# EAGLE design pre4 (EAGLE 5.10)
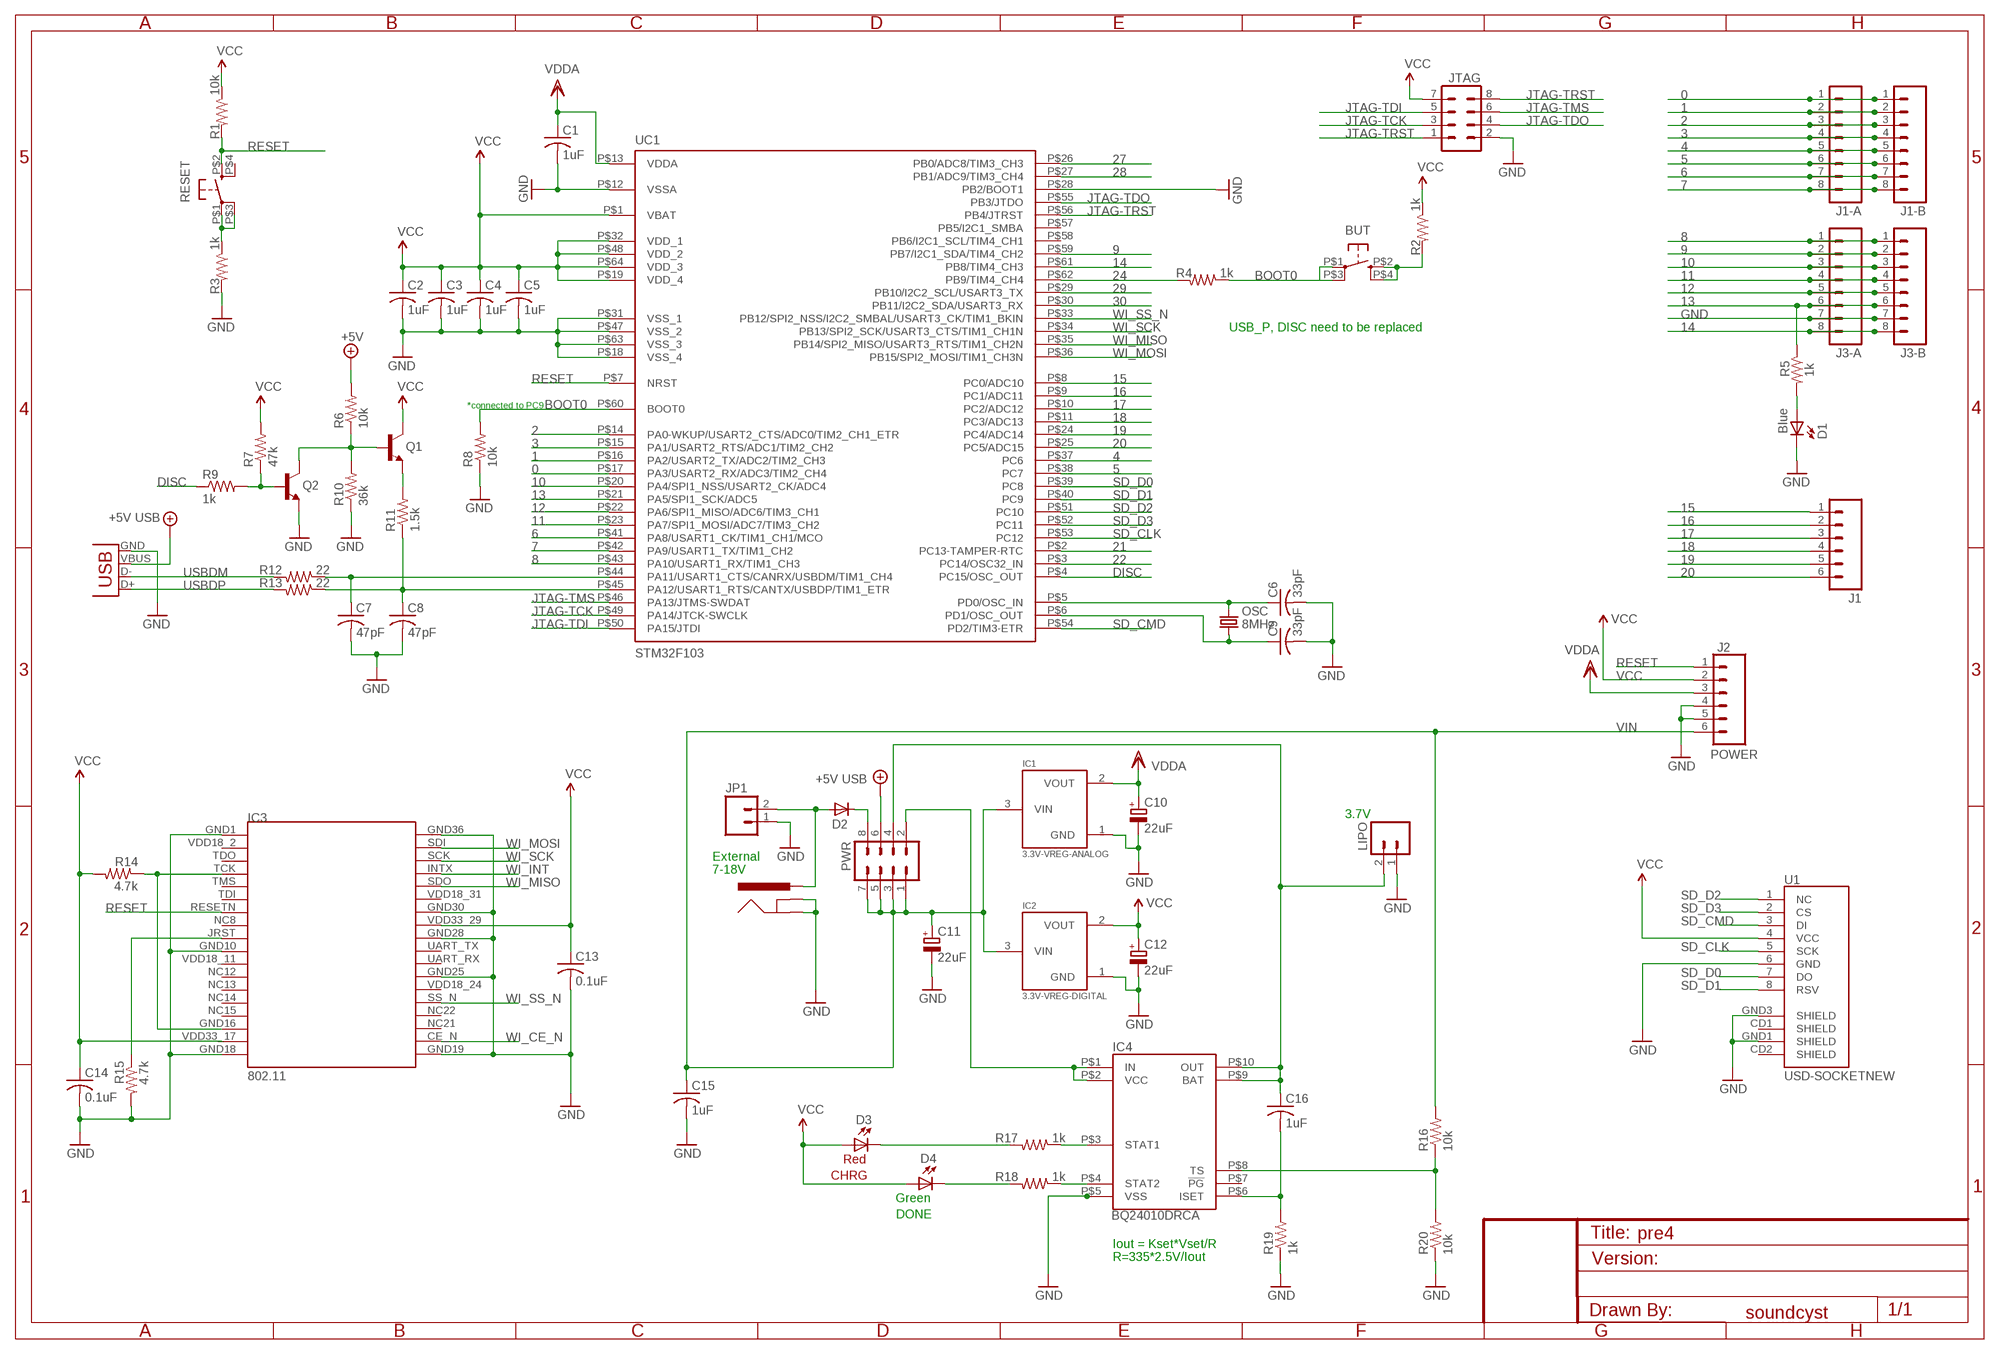
[diagram p0: schematic, sheet 1]

## Parts
BAR  POWER_JACKPTH  [POWER_JACK_PTH]
BUT  BUTTON-KMR241GLFS  [PUSHBUTTON-KMR241GLFS]
C1  1uF  C  [C0603]
C2  1uF  C  [C0603]
C3  1uF  C  [C0603]
C4  1uF  C  [C0603]
C5  1uF  C  [C0603]
C6  33pF  C  [C0603]
C7  47pF  C  [C0603]
C8  47pF  C  [C0603]
C9  33pF  C  [C0603]
C10  22uF  CPOL-EUUD-4X5,8  [UD-4X5,8_NICHICON]
C11  22uF  CPOL-EUUD-4X5,8  [UD-4X5,8_NICHICON]
C12  22uF  CPOL-EUUD-4X5,8  [UD-4X5,8_NICHICON]
C13  0.1uF  C  [C0603]
C14  0.1uF  C  [C0603]
C15  1uF  C  [C0603]
C16  1uF  C  [C0603]
D1  Blue  LED0603  [LED-0603]
D2  DIODE-SOD323-W  [SOD323-W]
D3  Red  LED0603  [LED-0603]
D4  Green  LED0603  [LED-0603]
IC1  3.3V-VREG-ANALOG  MCP1700T  [SOT23]
IC2  3.3V-VREG-DIGITAL  MCP1700T  [SOT23]
IC3  802.11  ZG2100MOD  [ZG2100MOD]
IC4  BQ24010DRCA  [PSON10-V2]
J1  M06SIP  [1X06]
J1-A  M08  [1X08]
J1-B  MA08-SQUARE  [1X08-SQUARE]
J2  POWER  M06SIP  [1X06]
J3-A  M08  [1X08]
J3-B  MA08-SQUARE  [1X08-SQUARE]
JP1  M02PTH  [1X02]
JTAG  MA04-2  [MA04-2]
LIPO  LiPo  M02-JST-2MM-SMT  [S2B-PH]
OSC  8MHz  CRYSTAL5X3  [CRYSTAL-SMD-5X3]
PWR  MA04-2  [MA04-2]
Q1  TRANSISTOR_NPNSOT23  [SOT23]
Q2  TRANSISTOR_NPNSOT23  [SOT23]
R1  10k  R  [R0603]
R2  1k  R  [R0603]
R3  1k  R  [R0603]
R4  1k  R  [R0603]
R5  1k  R  [R0603]
R6  10k  R  [R0603]
R7  47k  R  [R0603]
R8  10k  R  [R0603]
R9  1k  R  [R0603]
R10  36k  R  [R0603]
R11  1.5k  R  [R0603]
R12  22  R  [R0603]
R13  22  R  [R0603]
R14  4.7k  R  [R0603]
R15  4.7k  R  [R0603]
R16  10k  R  [R0603]
R17  1k  R  [R0603]
R18  1k  R  [R0603]
R19  1k  R  [R0603]
R20  10k  R  [R0603]
RESET  BUTTON-KMR241GLFS  [PUSHBUTTON-KMR241GLFS]
U1  USD-SOCKETNEW  [MICRO-SD-SOCKET-PP]
UC1  STM32F103  [TQFP-10X10-64]
X1  USBSMD  [USB-MINIB]

## Nets
0: J1-A.1 J1-B.1 UC1.P$17(PA3/USART2_RX/ADC3/TIM2_CH4)
1: J1-A.2 J1-B.2 UC1.P$16(PA2/USART2_TX/ADC2/TIM2_CH3)
2: J1-A.3 J1-B.3 UC1.P$14(PA0-WKUP/USART2_CTS/ADC0/TIM2_CH1_ETR)
3: J1-A.4 J1-B.4 UC1.P$15(PA1/USART2_RTS/ADC1/TIM2_CH2)
4: J1-A.5 J1-B.5 UC1.P$37(PC6)
5: J1-A.6 J1-B.6 UC1.P$38(PC7)
6: J1-A.7 J1-B.7 UC1.P$41(PA8/USART1_CK/TIM1_CH1/MCO)
7: J1-A.8 J1-B.8 UC1.P$42(PA9/USART1_TX/TIM1_CH2)
8: J3-A.1 J3-B.1 UC1.P$43(PA10/USART1_RX/TIM1_CH3)
9: J3-A.2 J3-B.2 UC1.P$59(PB7/I2C1_SDA/TIM4_CH2)
10: J3-A.3 J3-B.3 UC1.P$20(PA4/SPI1_NSS/USART2_CK/ADC4)
11: J3-A.4 J3-B.4 UC1.P$23(PA7/SPI1_MOSI/ADC7/TIM3_CH2)
12: J3-A.5 J3-B.5 UC1.P$22(PA6/SPI1_MISO/ADC6/TIM3_CH1)
13: J3-A.6 J3-B.6 R5.1 UC1.P$21(PA5/SPI1_SCK/ADC5)
14: J3-A.8 J3-B.8 UC1.P$61(PB8/TIM4_CH3)
15: J1.1 UC1.P$8(PC0/ADC10)
16: J1.2 UC1.P$9(PC1/ADC11)
17: J1.3 UC1.P$10(PC2/ADC12)
18: J1.4 UC1.P$11(PC3/ADC13)
19: J1.5 UC1.P$24(PC4/ADC14)
20: J1.6 UC1.P$25(PC5/ADC15)
21: UC1.P$2(PC13-TAMPER-RTC)
22: UC1.P$3(PC14/OSC32_IN)
24: R4.2 UC1.P$62(PB9/TIM4_CH4)
27: UC1.P$26(PB0/ADC8/TIM3_CH3)
28: UC1.P$27(PB1/ADC9/TIM3_CH4)
29: UC1.P$29(PB10/I2C2_SCL/USART3_TX)
30: UC1.P$30(PB11/I2C2_SDA/USART3_RX)
+5V: PWR.6 R6.2 X1.VBUS ; supply symbol labelled +5V USB
BOOT0: BUT.P$1 BUT.P$3 R4.1 R8.2 UC1.P$60(BOOT0)
DISC: R9.1 UC1.P$4(PC15/OSC_OUT)
GND [vcc]: BAR.GND BAR.GNDBREAK C1.2 C2.2 C3.2 C4.2 C5.2 C6.2 C7.2 C8.2 C9.2 C10.- C11.- C12.- C13.2 C14.2 C15.2 D1.C IC1.1(GND) IC2.1(GND) IC3.GND1 IC3.GND10 IC3.GND18 IC3.GND19 IC3.GND25 IC3.GND28 IC3.GND30 IC3.GND36 IC4.P$5(VSS) J2.4 J2.5 J3-A.7 J3-B.7 JP1.1 JTAG.2 LIPO.1 Q2.2(E) R3.2 R8.1 R10.1 R15.2 R19.1 R20.1 U1.6(GND) U1.GND1(SHIELD) U1.GND3(SHIELD) UC1.P$12(VSSA) UC1.P$18(VSS_4) UC1.P$28(PB2/BOOT1) UC1.P$31(VSS_1) UC1.P$47(VSS_2) UC1.P$63(VSS_3) X1.GND
JTAG-TCK: JTAG.3 UC1.P$49(PA14/JTCK-SWCLK)
JTAG-TDI: JTAG.5 UC1.P$50(PA15/JTDI)
JTAG-TDO: JTAG.4 UC1.P$55(PB3/JTDO)
JTAG-TMS: JTAG.6 UC1.P$46(PA13/JTMS-SWDAT)
JTAG-TRST: JTAG.1 JTAG.8 UC1.P$56(PB4/JTRST)
N$1 [vcc]: BAR.PWR D2.A JP1.2
N$2: C9.1 OSC.1 UC1.P$6(PD1/OSC_OUT)
N$3: IC4.P$8(TS) R16.1 R20.2
N$5: D2.C PWR.8
N$6: C6.1 OSC.3 UC1.P$5(PD0/OSC_IN)
N$7: D1.A R5.2
N$8: Q1.2(E) R11.2
N$9: Q1.1(B) Q2.3(C) R6.1 R10.2
N$10: Q2.1(B) R7.1 R9.2
N$11: C7.1 R12.1 UC1.P$44(PA11/USART1_CTS/CANRX/USBDM/TIM1_CH4)
N$12: C8.1 R11.1 R13.1 UC1.P$45(PA12/USART1_RTS/CANTX/USBDP/TIM1_ETR)
N$13: IC4.P$1(IN) IC4.P$2(VCC) PWR.2
N$16 [vcc]: C16.1 IC4.P$9(BAT) IC4.P$10(OUT) LIPO.2 PWR.4
N$18: IC3.GND16 IC3.TCK R14.1
N$19: C16.2 IC4.P$6(ISET) R19.2
N$20: D4.C R18.2
N$21: D3.C R17.2
N$22: IC4.P$3(STAT1) R17.1
N$23: IC4.P$4(STAT2) R18.1
N$25 [vcc]: R3.1 RESET.P$1 RESET.P$3
N$26: BUT.P$2 BUT.P$4 R2.2
N$27: IC3.JRST R15.1
RESET: IC3.RESETN(RSTN) J2.1 R1.2 RESET.P$2 UC1.P$7(NRST)
SD_CLK: U1.5(SCK) UC1.P$53(PC12)
SD_CMD: U1.3(DI) UC1.P$54(PD2/TIM3-ETR)
SD_D0: U1.7(DO) UC1.P$39(PC8)
SD_D1: U1.8(RSV) UC1.P$40(PC9)
SD_D2: U1.1(NC) UC1.P$51(PC10)
SD_D3: U1.2(CS) UC1.P$52(PC11)
USBDM: R12.2 X1.D-
USBDP: R13.2 X1.D+
VCC: C2.1 C3.1 C4.1 C5.1 C12.+ C13.1 C14.1 D3.A D4.A IC2.2(VOUT) IC3.VDD33_17 IC3.VDD33_29 J2.2 JTAG.7 Q1.3(C) R1.1 R2.1 R7.2 R14.2 U1.4(VCC) UC1.P$1(VBAT) UC1.P$19(VDD_4) UC1.P$32(VDD_1) UC1.P$48(VDD_2) UC1.P$64(VDD_3)
VDD: C1.1 C10.+ IC1.2(VOUT) J2.3 UC1.P$13(VDDA) ; supply symbol labelled VDDA
VIN: C11.+ C15.1 IC1.3(VIN) IC2.3(VIN) J2.6 PWR.1 PWR.3 PWR.5 PWR.7 R16.2
WI_CE_N: IC3.CE_N
WI_INT: IC3.INTX
WI_MISO: IC3.SDO UC1.P$35(PB14/SPI2_MISO/USART3_RTS/TIM1_CH2N)
WI_MOSI: IC3.SDI UC1.P$36(PB15/SPI2_MOSI/TIM1_CH3N)
WI_SCK: IC3.SCK UC1.P$34(PB13/SPI2_SCK/USART3_CTS/TIM1_CH1N)
WI_SS_N: IC3.SS_N UC1.P$33(PB12/SPI2_NSS/I2C2_SMBAL/USART3_CK/TIM1_BKIN)
Unconnected: IC3.NC8 IC3.NC12 IC3.NC13 IC3.NC14 IC3.NC15 IC3.NC21 IC3.NC22 IC3.TDI IC3.TDO IC3.TMS IC3.UART_RX IC3.UART_TX IC3.VDD18_2 IC3.VDD18_11 IC3.VDD18_24 IC3.VDD18_31 IC4.P$7(!PG) RESET.P$4 U1.CD1(SHIELD) U1.CD2(SHIELD) UC1.P$57(PB5/I2C1_SMBA) UC1.P$58(PB6/I2C1_SCL/TIM4_CH1)

## Notes on the sheet
- USB_P, DISC need to be replaced
- *connected to PC9
- 3.7V
- External
- 7-18V
- CHRG
- DONE
- Iout = Kset*Vset/R
- R=335*2.5V/Iout
- soundcyst

## Library data of the parts
BAR = SparkFun2:POWER_JACK: Power Jack This is the standard 5.5mm barrel jack for power. The PTH is the most common, proven, reliable, footprint. All others are experimental. The Slot footprint only works if the mill layer is transmitted to the PCB fab house so be warned. Spark Fun Electronics SKU : PRT-00119. Mating wall wart : TOL-00298 (and others)
BUT RESET = okie:BUTTON-KMR241GLFS
C1-C9 C13-C16 = ReplenishComponentLib:C
C10-C12 = rcl:CPOL-EU: POLARIZED CAPACITOR, European symbol
D1 D3 D4 = SparkFun:LED: LEDs Standard schematic elements and footprints for 5mm, 3mm, 1206, and 0603 sized LEDs. 5mm - Spark Fun Electronics SKU : COM-00529 (and others)
D2 = diode:DIODE-: DIODE
IC1 IC2 = okie:MCP1700T
IC3 = ZGLIB:ZG2100MOD: ZG2100 Module
IC4 = xkn_lib:BQ24010DRC
J1 J2 = SparkFun:M06: Header 6 Standard 6-pin 0.1" header. Use with straight break away headers (SKU : PRT-00116), right angle break away headers (PRT-00553), swiss pins (PRT-00743), machine pins (PRT-00117), and female headers (PRT-00115). Molex polarized connector foot print use with SKU : PRT-08094 with associated crimp pins and housings.
J1-A J3-A = SparkFun:M08: Header 8 Standard 8-pin 0.1" header. Use with straight break away headers (SKU : PRT-00116), right angle break away headers (PRT-00553), swiss pins (PRT-00743), machine pins (PRT-00117), and female headers (PRT-00115).
J1-B J3-B = SparkFun2:MA08-SQUARE
JP1 = SparkFun2:M02: Header 2 Standard 2-pin 0.1" header. Use with straight break away headers (SKU : PRT-00116), right angle break away headers (PRT-00553), swiss pins (PRT-00743), machine pins (PRT-00117), and female headers (PRT-00115). Molex polarized connector foot print use with SKU : PRT-08233 with associated crimp pins and housings.
JTAG PWR = con-lstb:MA04-2: PIN HEADER
LIPO = SparkFun:M02: Header 2 Standard 2-pin 0.1" header. Use with straight break away headers (SKU : PRT-00116), right angle break away headers (PRT-00553), swiss pins (PRT-00743), machine pins (PRT-00117), and female headers (PRT-00115). Molex polarized connector foot print use with SKU : PRT-08233 with associated crimp pins and housings.
OSC = SparkFun2:CRYSTAL: Crystals Various standard crystals. Proven footprints. Spark Fun Electronics SKU : COM-00534
Q1 Q2 = SparkFun2:TRANSISTOR_NPN: Transistor NPN BJT configuration in SOT23 package. MMBT2222 is the common NPN we use. Double check BCE configuration again layout.
R1-R20 = ReplenishComponentLib:R
U1 = SparkFun:USD-SOCKET: microSD Socket Push-push type uSD socket. Schematic element and footprint production proven. Spark Fun Electronics SKU : PRT-00127. tDoc lines correctly indicate media card edge positions when inserting (unlocked, locked, depressed).
UC1 = st-microelectronics:STM32F103
X1 = SparkFun2:USB: USB Connectors USB-B-PTH is fully proven SKU : PRT-00139 USB-miniB is fully proven SKU : PRT-00587 USB-A-PCB is untested. USB-A-H is throughly reviewed, but untested. Spark Fun Electronics SKU : PRT-00437 USB-B-SMT is throughly reviewed, but untested. Needs silkscreen touching up. USB-A-S has not been used/tested USB-MB-H has not been used/tested

## Net classes
0 default: width 0.203 mm, clearance 0.152 mm
1 vcc: width 0.254 mm, clearance 0.152 mm
2 gnd: width 0.305 mm, drill 0.508 mm, clearance 0.152 mm
3 usbvcc: width 0.508 mm, drill 0.508 mm, clearance 0.152 mm

## Board
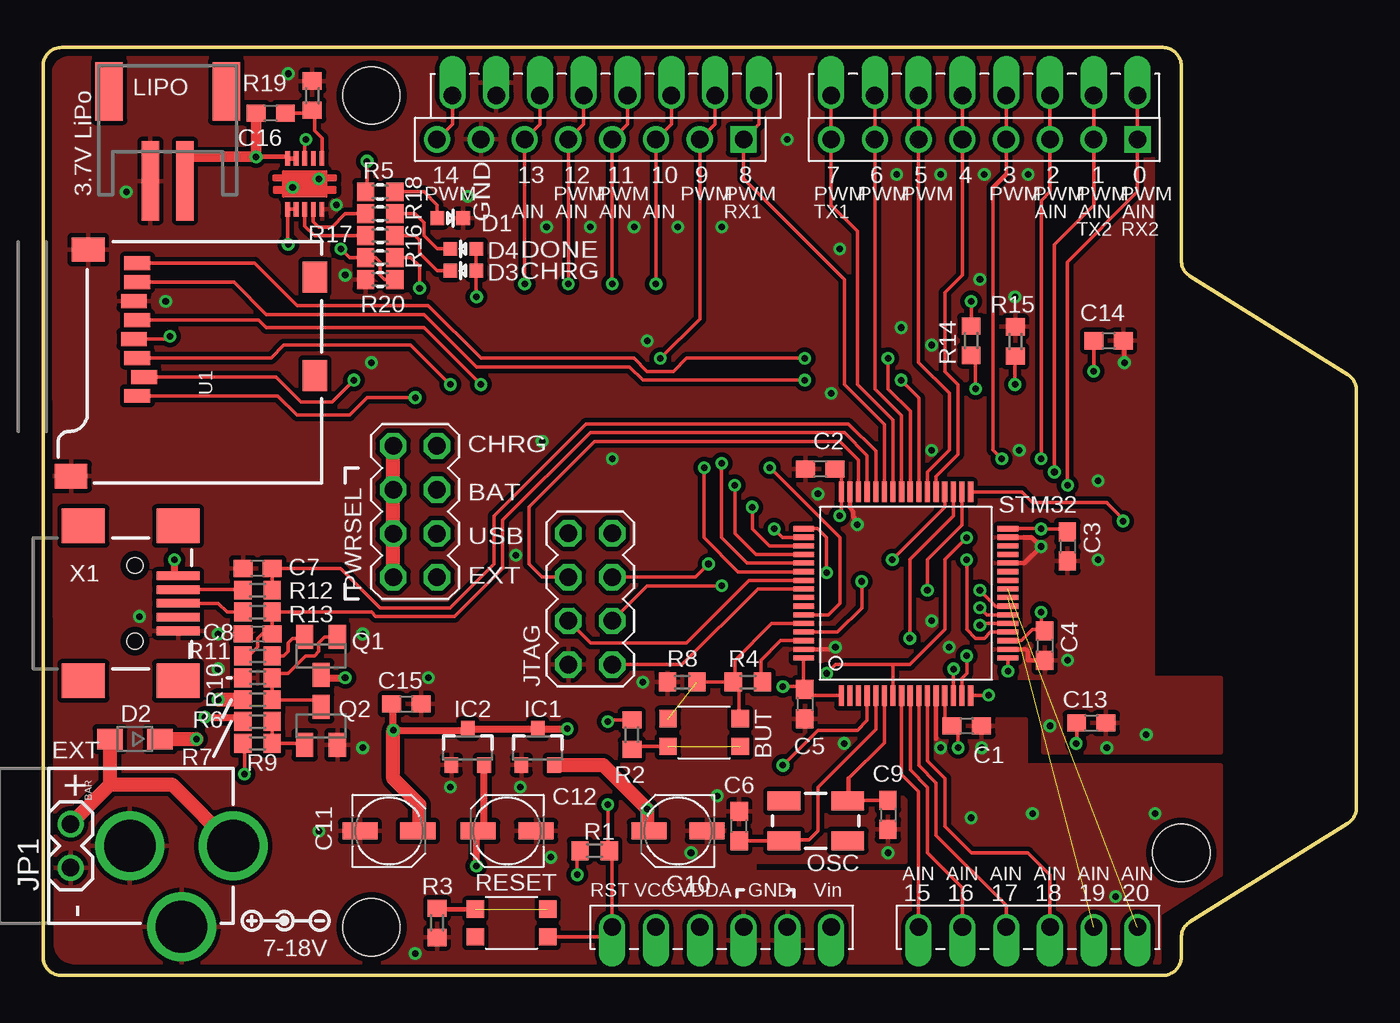
[diagram p1: board, top side]
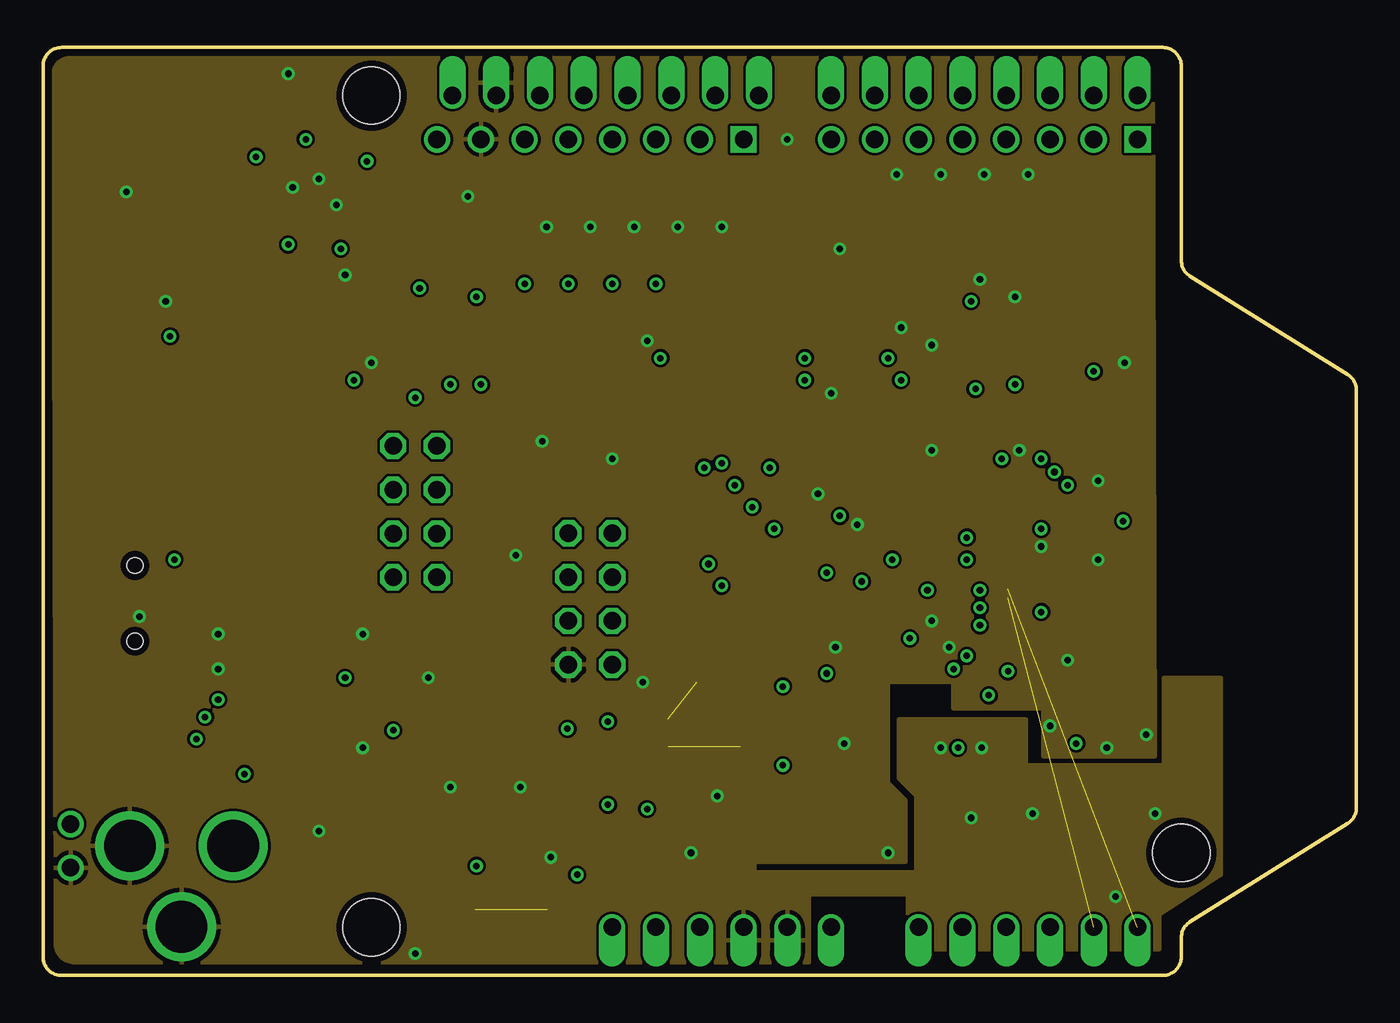
[diagram p2: board, inner layer gndplane]
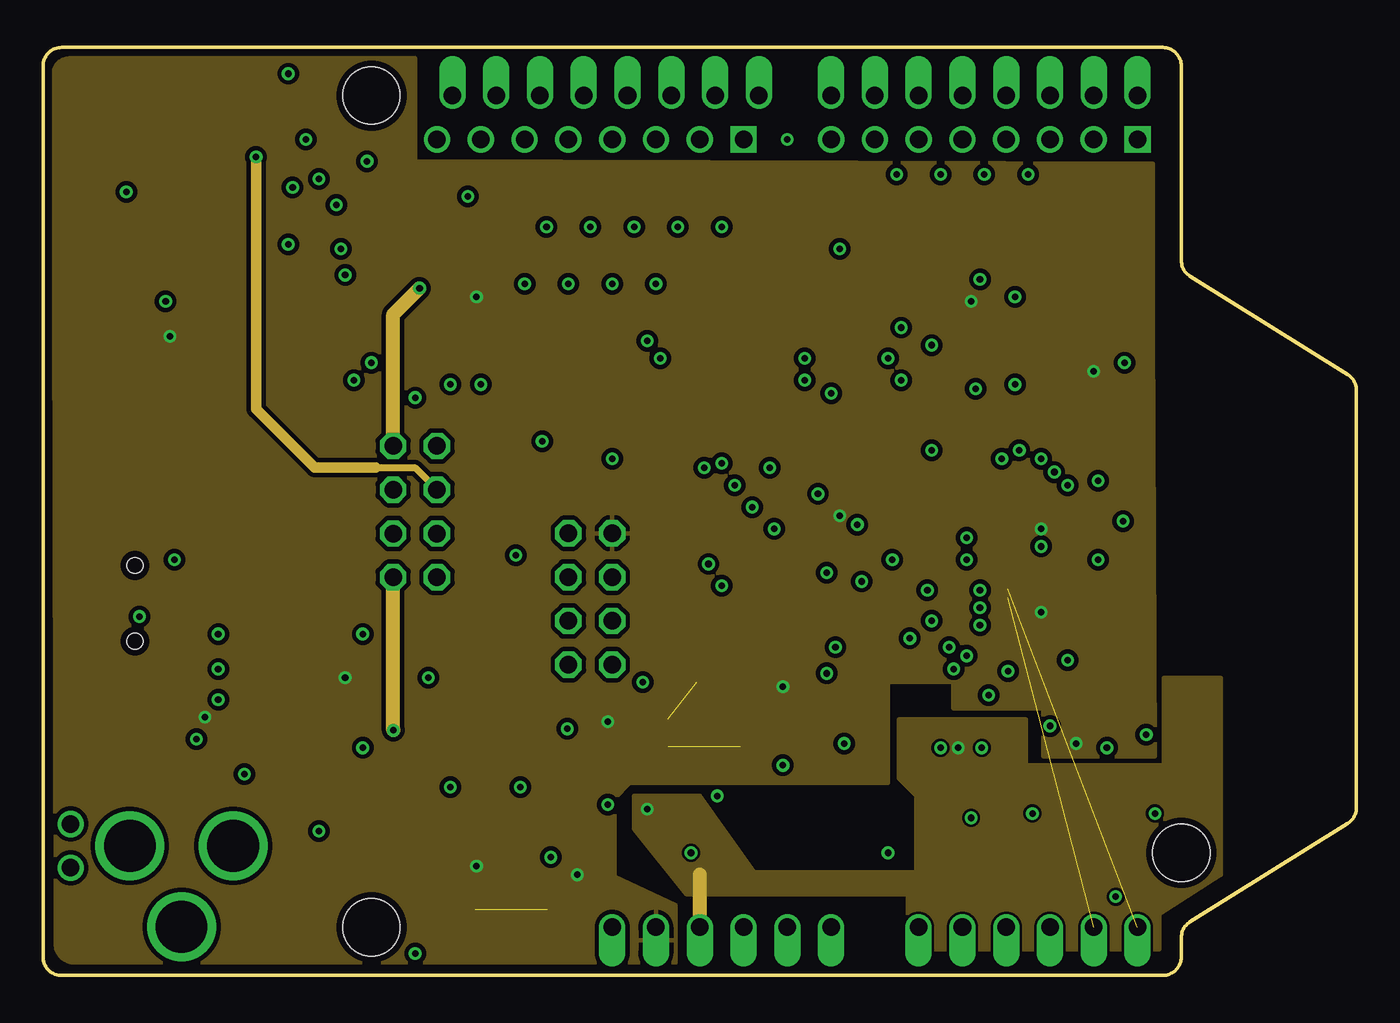
[diagram p3: board, inner layer Route15]
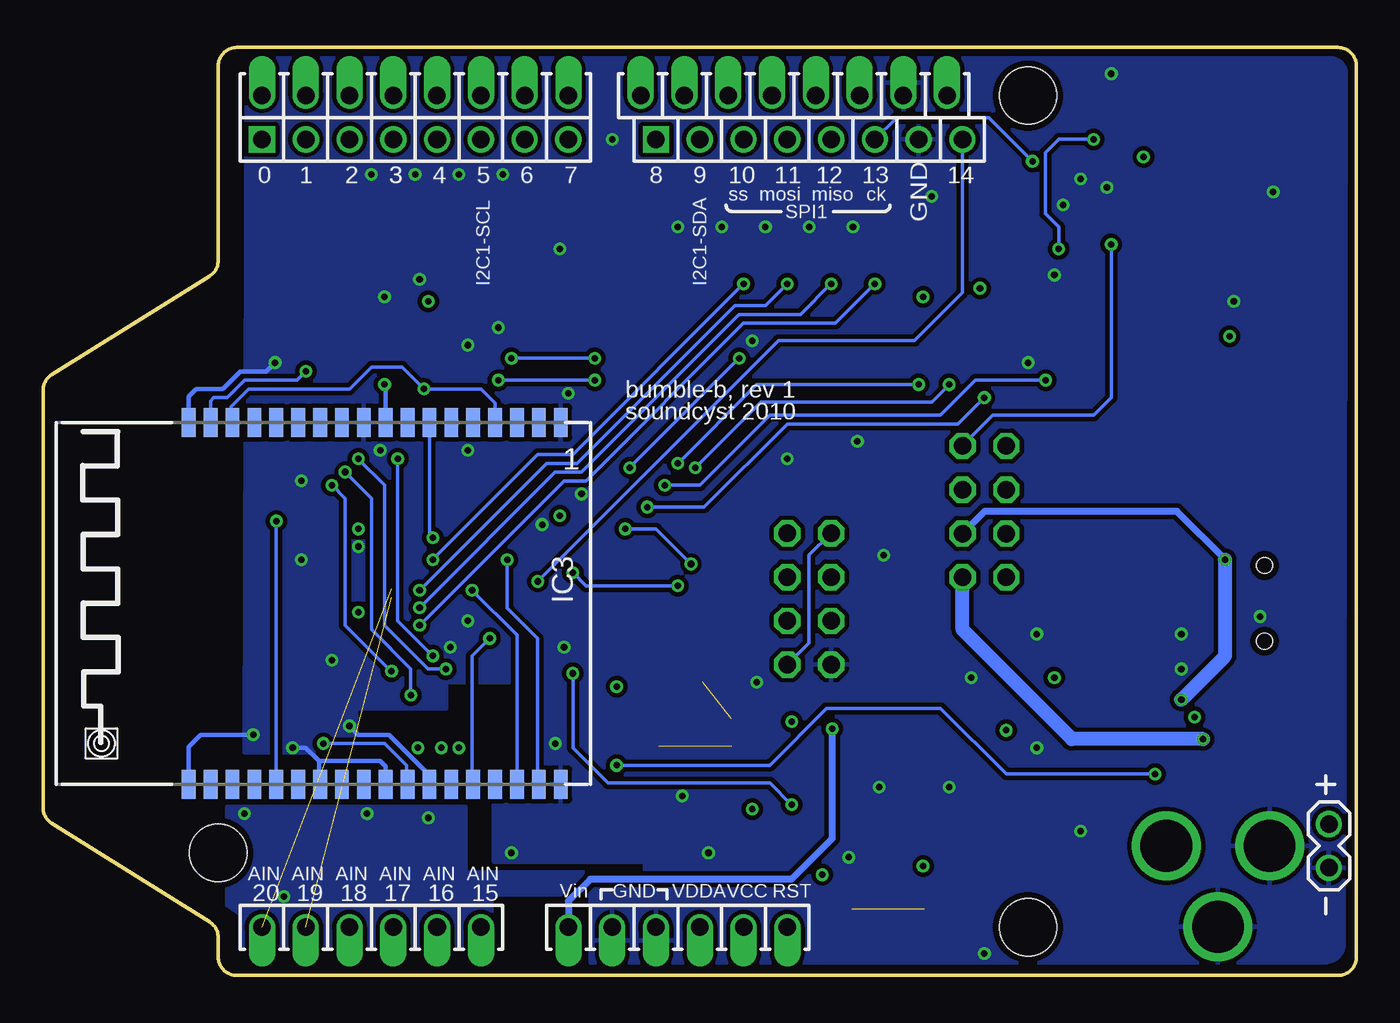
[diagram p4: board, bottom side, seen from below]

Size 76.2 x 53.85 mm. Coordinates in mm from the lower left corner, seen from the top.
Outline: 75.69,8.83 arc58 76.2,9.74 76.2,33.95 arc58 75.69,34.86 66.55,40.58 arc-58 66.04,41.49 66.04,52.77 arc90 64.96,53.85 1.08,53.85 arc90 0,52.77 0,1.08 arc90 1.08,0 64.96,0 arc90 66.04,1.08 66.04,2.2 arc-58 66.55,3.11 75.69,8.83
Copper layers (1*2*15*16): Top 0.0356mm / dielectric 1.5011mm / gndplane 0.0356mm / dielectric 0.1499mm / Route15 0.0356mm / dielectric 0.2007mm / Bottom 0.0356mm
Design rules "LaenPCBOrder *": minimum track width 6mil, minimum drill 13mil, track to track 6mil, track to pad 6mil, pad to pad 6mil, via to via 6mil, smd to smd 6mil, copper to edge 15mil, drill to drill 6mil, minimum pad ring 7mil, minimum via ring 7mil, stop-mask expansion 4mil, vias tented up to drill 0mil, thermal gap 10mil

### Footprints (pad centres in the part's own frame; a part is rotated, then mirrored left to right if it is on the bottom)
POWER_JACK_PTH = drill 2.997 round: GND 0,7.7; GNDBREAK 4.7,10.7; PWR 0,13.7
PUSHBUTTON-KMR241GLFS = smd 1 x 1: P$1 2.1,0.8; P$2 2.1,-0.8; P$3 -2.1,0.8; P$4 -2.1,-0.8
C0603 = smd 1.1 x 1: 1 -0.85,0; 2 0.85,0
UD-4X5,8_NICHICON = smd 2.032 x 1: + 1.679,0; - -1.679,0
LED-0603 = smd 0.8 x 0.8: A 0,-0.75; C 0,0.75
SOD323-W = smd 1.5 x 1.2: A 1.45,0; C -1.45,0
SOT23 = smd 0.8 x 0.9: 1 -0.95,-1; 2 0.95,-1; 3 0,1.1
ZG2100MOD = smd 0.8 x 1.7: CE_N 6.63,10.12; GND1 -13.69,-10.88; GND10 -2.26,-10.88; GND16 5.36,-10.88; GND18 7.9,-10.88; GND19 7.9,10.12; GND25 0.28,10.12; GND28 -3.53,10.12; GND30 -6.07,10.12; GND36 -13.69,10.12; INTX -9.88,10.12; JRST -3.53,-10.88; NC8 -4.8,-10.88; NC12 0.28,-10.88; NC13 1.55,-10.88; NC14 2.82,-10.88; NC15 4.09,-10.88; NC21 5.36,10.12; NC22 4.09,10.12; RESETN -6.07,-10.88; SCK -11.15,10.12; SDI -12.42,10.12; SDO -8.61,10.12; SS_N 2.82,10.12; TCK -9.88,-10.88; TDI -7.34,-10.88; TDO -11.15,-10.88; TMS -8.61,-10.88; UART_RX -0.99,10.12; UART_TX -2.26,10.12; VDD18_2 -12.42,-10.88; VDD18_11 -0.99,-10.88; VDD18_24 1.55,10.12; VDD18_31 -7.34,10.12; VDD33_17 6.63,-10.88; VDD33_29 -4.8,10.12
PSON10-V2 = smd 0.85 x 0.28: P$1 -1.475,1; P$2 -1.475,0.5; P$3 -1.475,0; P$4 -1.475,-0.5; P$5 -1.475,-1; P$6 1.475,-1; P$7 1.475,-0.5; P$8 1.475,0; P$9 1.475,0.5; P$10 1.475,1
1X06 = drill 1.016 offset: 1 0,0; 2 2.54,0; 3 5.08,0; 4 7.62,0; 5 10.16,0; 6 12.7,0
1X08 = drill 1.016 offset: 1 0,0; 2 2.54,0; 3 5.08,0; 4 7.62,0; 5 10.16,0; 6 12.7,0; 7 15.24,0; 8 17.78,0
1X08-SQUARE = drill 1.016 square: 1 -8.89,0 | drill 1.016 round: 2 -6.35,0; 3 -3.81,0; 4 -1.27,0; 5 1.27,0; 6 3.81,0; 7 6.35,0; 8 8.89,0
1X02 = drill 1.016 round: 1 0,0; 2 2.54,0
MA04-2 = drill 1.016 octagon: 1 -3.81,-1.27; 2 -3.81,1.27; 3 -1.27,-1.27; 4 -1.27,1.27; 5 1.27,-1.27; 6 1.27,1.27; 7 3.81,-1.27; 8 3.81,1.27
S2B-PH = smd 1 x 4.6: 1 -1,-3.7; 2 1,-3.7 | smd 1.6 x 3.4: NC1 -3.4,1.5; NC2 3.4,1.5
CRYSTAL-SMD-5X3 = smd 1.9 x 1.1: 1 -1.85,-1.15; 2 1.85,-1.15; 3 1.85,1.15; 4 -1.85,1.15
SOT23' = smd 1 x 1.4: 1 -0.95,-1.1; 2 0.95,-1.1; 3 0,1.1
R0603 = smd 1 x 1.1: 1 -0.85,0; 2 0.85,0
MICRO-SD-SOCKET-PP = smd 0.8 x 1.5: 1 -8.94,10.7; 2 -7.84,10.3; 3 -6.74,10.7; 4 -5.64,10.9; 5 -4.54,10.7; 6 -3.44,10.9; 7 -2.34,10.7; 8 -1.24,10.7 | smd 1.8 x 1.4: CD1 -2.05,0.4; CD2 -7.75,0.4 | smd 1.4 x 1.9: GND1 -13.6,14.55; GND3 -0.45,13.55
STAND-OFF = hole 3.302: 0,0
TQFP-10X10-64 = smd 1.2 x 0.3: P$1 -5.936,3.75; P$2 -5.936,3.25; P$3 -5.936,2.75; P$4 -5.936,2.25; P$5 -5.936,1.75; P$6 -5.936,1.25; P$7 -5.936,0.75; P$8 -5.936,0.25; P$9 -5.936,-0.25; P$10 -5.936,-0.75; P$11 -5.936,-1.25; P$12 -5.936,-1.75; P$13 -5.936,-2.25; P$14 -5.936,-2.75; P$15 -5.936,-3.25; P$16 -5.936,-3.75; P$33 5.886,-3.75; P$34 5.886,-3.25; P$35 5.886,-2.75; P$36 5.886,-2.25; P$37 5.886,-1.75; P$38 5.886,-1.25; P$39 5.886,-0.75; P$40 5.886,-0.25; P$41 5.886,0.25; P$42 5.886,0.75; P$43 5.886,1.25; P$44 5.886,1.75; P$45 5.886,2.25; P$46 5.886,2.75; P$47 5.886,3.25; P$48 5.886,3.75 | smd 0.3 x 1.2: P$17 -3.75,-5.911; P$18 -3.25,-5.911; P$19 -2.75,-5.911; P$20 -2.25,-5.911; P$21 -1.75,-5.911; P$22 -1.25,-5.911; P$23 -0.75,-5.911; P$24 -0.25,-5.911; P$25 0.25,-5.911; P$26 0.75,-5.911; P$27 1.25,-5.911; P$28 1.75,-5.911; P$29 2.25,-5.911; P$30 2.75,-5.911; P$31 3.25,-5.911; P$32 3.75,-5.911; P$49 3.75,5.936; P$50 3.25,5.936; P$51 2.75,5.936; P$52 2.25,5.936; P$53 1.75,5.936; P$54 1.25,5.936; P$55 0.75,5.936; P$56 0.25,5.936; P$57 -0.25,5.936; P$58 -0.75,5.936; P$59 -1.25,5.936; P$60 -1.75,5.936; P$61 -2.25,5.936; P$62 -2.75,5.936; P$63 -3.25,5.936; P$64 -3.75,5.936
USB-MINIB = smd 2.5 x 0.5: D+ 2.5,0; D- 2.5,0.8; GND 2.5,-1.6; ID 2.5,-0.8; VBUS 2.5,1.6 | smd 2.5 x 2: GND@1 -3,-4.5; GND@2 -3,4.5; GND@3 2.5,4.5; GND@4 2.5,-4.5 | hole 0.9: 0,2.2; 0,-2.2

### Placement (x,y rotation side)
BAR  -2.67,7.52 270 top
BUT  38.35,14.1 0 top
C1  53.59,14.48 0 top
C2  45.09,29.39 180 top
C3  59.44,24.89 270 top
C4  58.12,19.13 270 top
C5  44.2,15.75 270 top
C6  40.39,8.66 90 top
C7  12.45,23.62 180 top
C8  12.45,19.81 180 top
C9  49.02,9.32 270 top
C10  36.83,8.38 180 top
C11  20.07,8.38 0 top
C12  26.92,8.38 180 top
C13  60.82,14.65 0 top
C14  61.82,36.83 0 top
C15  21.08,15.75 0 top
C16  13.21,50.04 0 top
D1  23.62,43.94 270 top
D2  5.33,13.72 180 top
D3  24.38,40.89 90 top
D4  24.38,42.16 90 top
IC1  28.7,13.21 0 top
IC2  24.64,13.21 0 top
IC3  59.85,21.21 180 bottom
IC4  15.18,45.93 90 top
J1  50.8,2.79 0 top
J1-A  63.5,51.05 180 top
J1-B  54.61,48.51 180 top
J2  33.02,2.79 0 top
J3-A  41.53,51.05 180 top
J3-B  31.75,48.51 180 top
JP1  1.6,6.25 90 top
JTAG  31.75,21.84 90 top
LIPO  7.23,49.8 0 top
OSC  44.83,8.97 180 top
PWR  21.58,26.91 270 top
Q1  [SOT23']  16.13,18.54 180 top
Q2  [SOT23']  16.13,14.48 0 top
R1  32,7.24 0 top
R2  34.16,13.97 270 top
R3  22.86,3.05 270 top
R4  40.89,17.02 0 top
R5  19.56,45.47 0 top
R6  12.45,16 180 top
R7  12.45,14.73 180 top
R8  37.08,17.02 0 top
R9  12.45,13.46 0 top
R10  12.45,17.27 0 top
R11  12.45,18.54 0 top
R12  12.45,22.35 180 top
R13  12.45,21.08 180 top
R14  53.85,36.83 90 top
R15  56.41,36.79 90 top
R16  19.56,41.66 0 top
R17  19.56,42.93 0 top
R18  19.56,44.2 0 top
R19  15.62,51.05 270 top
R20  19.56,40.39 0 top
RESET  27.18,3.05 0 top
U1  16.17,42.57 90 top
U$1  STAND-OFF  [STAND-OFF]  19.05,2.79 0 top
U$4  STAND-OFF  [STAND-OFF]  19.05,51.05 0 top
U$10  STAND-OFF  [STAND-OFF]  66.04,7.11 0 top
UC1  50.06,22.17 90 top
X1  5.33,21.59 0 top

### Tracks (layer width: path | path; a pad name or v marks a point on that pad's centre or on a via)
0  (via drill 0.38)
  Top 0.203: UC1.P$17 v55.97,17.66 v55.98,17.65 | v59.44,28.45 59.44,41.4 63.5,45.47 J1-B.1 J1-A.1
  Bottom 0.203: v55.98,17.65 56.01,17.65 58.67,20.32 58.67,27.69 v59.44,28.45
1  (via drill 0.38)
  Top 0.203: UC1.P$16 54.85,16.24 | v58.67,29.21 58.67,42.42 60.96,44.7 J1-B.2 J1-A.2
  Top 0.254: 54.85,16.24 v54.86,16.26
  Bottom 0.203: v54.86,16.26 54.86,17.78 57.15,20.07 57.15,27.69 v58.67,29.21
2  (via drill 0.38)
  Top 0.203: UC1.P$14 52.81,17.76 | v57.91,29.97 57.91,44.96 58.42,45.47 J1-B.3 J1-A.3
  Top 0.254: 52.81,17.76 v52.83,17.78
  Bottom 0.203: v57.91,29.97 56.39,28.45 56.39,20.32 53.85,17.78 v52.83,17.78
3  (via drill 0.38)
  Top 0.203: UC1.P$15 53.31,17.25 53.59,17.53 v53.59,18.54 | 55.88,46.48 J1-B.4 J1-A.4 | 55.12,45.72 55.12,30.48 v55.63,29.97
  Top 0.254: 55.12,45.72 55.88,46.48
  Bottom 0.203: v53.59,18.54 55.63,20.57 v55.63,29.97
4
  Top 0.203: J1-A.5 J1-B.5 53.34,40.64 52.32,39.62 52.32,35.05 53.09,34.29 53.09,30.23 51.81,28.95 UC1.P$37
5
  Top 0.203: J1-A.6 J1-B.6 50.8,35.56 52.58,33.78 52.58,30.48 51.31,29.21 UC1.P$38
6
  Top 0.203: J1-A.7 J1-B.7 48.26,34.04 49.81,32.48 UC1.P$41
7
  Top 0.203: J1-A.8 J1-B.8 45.72,44.7 47.24,43.18 47.24,34.29 49.31,32.22 UC1.P$42
8
  Top 0.203: UC1.P$43 48.81,31.96 46.48,34.29 46.48,40.39 40.64,46.23 J3-B.1 41.53,49.4 J3-A.1
9  (via drill 0.38)
  Top 0.203: J3-A.2 38.99,49.4 J3-B.2 38.1,38.1 v35.81,35.81 | UC1.P$59 45.56,20.92 46.23,21.59 46.23,25.4 v42.16,29.46
  Bottom 0.203: v42.16,29.46 v35.81,35.81
10  (via drill 0.38)
  Top 0.203: J3-A.3 36.45,49.4 J3-B.3 v35.56,40.13 | v53.59,24.13 53.59,20.07 54.1,19.56 54.61,19.56 54.98,19.92 UC1.P$20
  Bottom 0.203: v53.59,24.13 47.5,30.23 45.47,30.23 v35.56,40.13
11  (via drill 0.38)
  Top 0.203: J3-A.4 33.91,49.4 J3-B.4 v33.02,40.13 | UC1.P$23 55.28,21.42 v54.36,22.35
  Bottom 0.203: v33.02,40.13 34.29,38.86 36.07,38.86 45.21,29.72 46.99,29.72 v54.36,22.35
12  (via drill 0.38)
  Top 0.203: J3-A.5 31.37,49.4 J3-B.5 v30.48,40.13 | UC1.P$22 54.77,20.92 v54.36,21.34
  Bottom 0.203: v30.48,40.13 32.26,38.35 35.81,38.35 44.96,29.21 46.48,29.21 v54.36,21.34
13  (via drill 0.38)
  Top 0.203: J3-A.6 28.83,49.4 J3-B.6 v27.94,40.13 | UC1.P$21 54.46,20.42 v54.36,20.32 | v18.8,47.24 18.8,45.55 R5.1
  Bottom 0.203: v27.94,40.13 30.23,37.85 35.56,37.85 44.7,28.7 45.97,28.7 v54.36,20.32 | J3-B.6 26.67,49.78 21.34,49.78 v18.8,47.24
14  (via drill 0.38)
  Top 0.203: J3-A.8 23.75,49.4 J3-B.8 | v47.5,22.86 47.5,21.34 46.09,19.92 UC1.P$61
  Bottom 0.203: v47.5,22.86 33.53,36.83 25.65,36.83 22.86,39.62 J3-B.8
15
  Top 0.203: UC1.P$8 49.81,11.65 50.8,10.67 J1.1
16
  Top 0.203: UC1.P$9 50.31,11.92 51.31,10.92 51.31,7.11 53.34,5.08 J1.2
17
  Top 0.203: UC1.P$10 50.81,12.18 51.82,11.18 51.82,8.13 55.88,4.06 J1.3
18
  Top 0.203: UC1.P$11 51.31,12.44 52.32,11.43 52.32,8.64 53.85,7.11 57.15,7.11 58.42,5.84 J1.4
19  (1 unrouted)
20  (1 unrouted)
24
  Top 0.203: UC1.P$62 42.79,19.42 41.66,18.29 41.66,17.11 R4.2
+5V  (via drill 0.38)
  Top 0.406: v7.62,24.13 7.62,23.19 X1.VBUS
  Top 0.813: R6.2 v10.16,16
  Bottom 0.406: PWR.6 21.57,26.92 10.41,26.92 v7.62,24.13
  Bottom 0.813: v10.16,16 7.62,18.54 v7.62,24.13
BOOT0  (1 unrouted)
  Top 0.203: UC1.P$60 42.27,20.42 40.13,18.29 40.13,17.11 R4.1 | R4.1 R8.2 | BUT.P$1 40.39,14.9 40.39,17.02 R4.1
DISC  (via drill 0.38)
  Top 0.203: UC1.P$4 47.81,14.79 47.24,14.22 44.96,14.22 v42.93,12.19 | v11.68,11.68 11.68,13.37 R9.1
  Bottom 0.203: v42.93,12.19 34.04,12.19 30.73,15.49 24.13,15.49 20.32,11.68 v11.68,11.68
GND  (via drill 0.38)
  Top 0.254: 51.81,13.72 UC1.P$12 | C1.2 54.61,14.14 | v62.74,35.56 62.74,36.26 C14.2 | UC1.P$31 57.38,25.42 v57.91,24.89 56.94,23.92 UC1.P$28 | UC1.P$18 57.02,18.92 57.15,18.8 57.15,18.29 58.1,18.29 C4.2 | UC1.P$63 45.85,18.92 v45.97,19.05 | UC1.P$47 46.81,27.15 46.99,26.92 46.99,26.67 v47.24,26.16
  Bottom 0.254: IC3.GND18 67.75,33.59 67.31,34.04 65.79,34.04 64.77,35.05 63.25,35.05 v62.74,35.56 | IC3.GND19 67.75,13.27 67.06,13.97 v64.01,13.97 | IC3.GND30 53.78,11.62 56.13,13.97 57.91,13.97 v58.42,14.48 | IC3.GND28 56.32,12.13 56.64,12.45 60.2,12.45 | 60.2,12.45 60.96,13.21 v61.72,13.21 | 60.2,12.45 60.2,11.15 IC3.GND25
  other vias: 49.02,7.11 53.85,9.14 54.46,13.21 59.44,18.29 56.39,39.37 43.18,48.51 45.72,33.78 44.96,27.94 52.07,13.21 64.52,9.4 57.4,9.4 62.23,4.57 34.8,17.02 18.54,13.21 22.35,17.27 23.62,10.92 27.69,10.92 16,8.38 29.46,6.86 39.12,10.41 7.11,39.12 46.48,13.46 17.02,44.7 14.48,45.72 16,46.23 24.64,45.21 17.53,40.64 4.83,45.47 14.22,52.32 51.56,20.57 52.58,19.05 21.59,1.27 10.16,19.81 5.59,20.83 10.16,17.78 37.59,7.11 29.21,43.43 31.75,43.43 34.29,43.43 36.83,43.43 39.37,43.43 46.23,42.16 35.05,36.83 28.96,30.99 19.05,35.56 27.43,24.38 33.02,29.97 18.54,19.81 61.21,28.7 49.78,37.59 51.56,36.58 52.07,46.48 49.53,46.48 54.61,46.48 54.36,40.39 57.15,46.48 51.56,30.48 56.64,30.48 61.21,24.13
  pour gndplane: 64.39,53.21 64.52,12.7 58.04,12.7 58.04,15.49 52.83,15.49 52.83,17.02 49.02,17.02 49.02,11.18 50.04,10.16 50.04,6.6 41.27,6.6 41.27,5.97 50.67,5.97 50.67,10.41 49.66,11.43 49.66,14.86 57.02,14.86 57.02,12.19 65.02,12.19 65.02,17.27 68.33,17.27 68.33,5.84 64.77,3.53 64.77,1.52 50.16,1.52 50.16,4.7 44.45,4.7 44.45,0.76 1.83,0.76 arc-89 0.73,1.84 0.61,52.3 arc-91 1.53,53.21
  pour Bottom (isolate 0.254): 64.39,53.21 64.52,12.95 58.04,12.95 58.04,15.49 52.83,15.49 52.83,17.02 49.02,17.02 49.02,11.18 50.04,10.16 50.04,6.6 41.27,6.6 41.27,5.97 51.69,5.97 51.69,9.78 65.53,9.78 65.53,4.06 64.77,3.56 64.77,1.52 50.16,1.52 50.16,4.7 44.45,4.7 44.45,0.76 1.83,0.76 arc-89 0.73,1.84 0.61,52.3 arc-91 1.53,53.21
  pour Top (isolate 0.254): 64.39,53.21 64.39,17.27 68.33,17.27 68.33,12.95 58.04,12.95 58.04,17.27 49.28,17.27 49.28,10.92 50.04,10.16 50.04,6.6 41.27,6.6 41.27,5.97 51.69,5.97 51.69,14.86 57.02,14.86 57.02,12.19 68.33,12.19 68.33,5.84 64.77,3.56 64.77,0.76 1.83,0.76 arc-89 0.73,1.84 0.61,52.3 arc-91 1.53,53.21
JTAG-TCK  (via drill 0.38)
  Top 0.203: v39.37,22.61 35.05,22.61 JTAG.3 | UC1.P$49 44.94,25.92 45.47,25.4 v45.47,23.37
  Bottom 0.203: v45.47,23.37 44.7,22.61 v39.37,22.61
JTAG-TDI  (via drill 0.38)
  Top 0.203: JTAG.5 37.85,23.11 v38.61,23.88 | UC1.P$50 42.9,25.42 v42.42,25.91
  Bottom 0.203: v38.61,23.88 40.64,25.91 v42.42,25.91
JTAG-TDO
  Top 0.203: UC1.P$55 40.96,22.92 37.34,19.3 31.75,19.3 JTAG.4
JTAG-TMS
  Top 0.203: UC1.P$46 47.31,29.9 46.23,30.99 32,30.99 28.19,27.18 28.19,23.88 28.96,23.11 JTAG.6
JTAG-TRST
  Top 0.203: JTAG.1 37.08,18.03 41.47,22.42 UC1.P$56
  Bottom 0.203: JTAG.8 31.75,24.38 31.75,19.3 JTAG.1
N$1
  Top 0.813: JP1.2 3.89,11.07 | 3.89,11.07 7.48,11.07 BAR.PWR | D2.A 3.88,11.08 3.89,11.07
N$2
  Top 0.203: UC1.P$6 48.81,13.51 46.74,11.43 | 46.74,10.17 49.27,10.17
  Top 0.254: 46.74,11.43 46.74,10.17 OSC.1 | 49.27,10.17 C9.1
N$3  (via drill 0.38)
  Top 0.203: IC4.P$8 15.18,48.45 v15.24,48.51 | R20.2 19.81,40.39 19.56,40.64 19.56,41.4 19.3,41.66 R16.1 17.78,41.66 v17.27,42.16
  Bottom 0.203: v15.24,48.51 17.27,48.51 18.03,47.75 18.03,44.2 17.27,43.43 v17.27,42.16
N$5  (via drill 0.38)
  Top 0.813: D2.C v8.89,13.72
  Route15 0.61: PWR.8 22.86,23.17
  Bottom 0.813: v8.89,13.72 16.51,13.72 22.86,20.07 PWR.8
N$6
  Top 0.203: UC1.P$5 48.31,14.28 44.96,10.92 44.96,8.38 44.45,7.87 43.04,7.87 | C6.1 OSC.3
  Top 0.254: OSC.3 43.04,7.87 | C6.1
N$7
  Top 0.203: R5.2 22.1,45.47 22.86,44.7 D1.A
N$8
  Top 0.203: R11.2 13.97,18.54 14.22,18.8 14.22,19.3 14.48,19.56 15.1,19.56 Q1.2
N$9
  Top 0.203: Q2.3 15.71,16 R6.1 R10.2 13.55,17.53 14.22,17.53 15.24,18.54 15.75,18.54 16,18.8 16,19.3 16.34,19.64 Q1.1
N$10
  Top 0.203: R7.1 R9.2 15.1,13.46 Q2.1
N$11
  Top 0.203: R12.1 C7.1 17.27,23.62 19.56,21.34 23.62,21.34 26.16,23.88 26.16,26.67 31.5,32 46.74,32 48.31,30.43 UC1.P$44
N$12
  Top 0.203: R11.1 11.94,18.54 12.45,19.05 12.45,19.56 12.7,19.81 C8.1 R13.1 19.05,21.08 19.3,20.83 23.88,20.83 26.67,23.62 26.67,26.42 31.75,31.5 46.48,31.5 47.81,30.17 UC1.P$45
N$13  (via drill 0.38)
  Top 0.203: IC4.P$2 IC4.P$1 14.18,42.46 v14.22,42.42
  Bottom 0.203: PWR.2 22.85,30.74 21.08,32.51 15.24,32.51 14.22,33.53 v14.22,42.42
N$16  (via drill 0.38)
  Top 0.254: IC4.P$9 IC4.P$10 14.09,47.5 v12.36,47.5
  Top 0.61: C16.1 v12.36,47.5 8.13,47.5 8.13,46.1 LIPO.2
  Route15 0.406: 19.3,29.46 21.57,29.46 PWR.4
  Route15 0.61: 19.3,29.46 15.75,29.46 12.36,32.85 v12.36,47.5
N$18  (via drill 0.38)
  Top 0.203: v54.1,34.04 54.1,35.73
  Top 0.254: 54.1,35.73 R14.1
  Bottom 0.203: IC3.TCK 49.97,33.21 50.8,34.04 v54.1,34.04 55.37,35.31 57.15,35.31 58.42,34.04 64.26,34.04 65.28,33.02 65.28,32.15
  Bottom 0.254: 65.28,32.15 IC3.GND16
N$19
  Top 0.203: IC4.P$6 16.18,48.59 15.75,49.02 15.75,50.08 R19.2 15.46,50.04 C16.2
N$20
  Top 0.203: R18.2 21.59,44.2 22.1,43.69 22.1,42.93 22.86,42.16 D4.C
N$21
  Top 0.203: R17.2 21.59,42.93 21.84,42.67 21.84,41.91 22.86,40.89 D3.C
N$22
  Top 0.203: IC4.P$3 15.18,43.49 15.75,42.93 R17.1
N$23
  Top 0.203: IC4.P$4 15.68,43.75 16,43.43 16.76,43.43 17.53,44.2 R18.1
N$25  (1 unrouted)
  Top 0.254: RESET.P$3 22.91,3.85 R3.1
N$26  (1 unrouted)
  Top 0.203: BUT.P$4 34.34,13.3 R2.2
N$27  (via drill 0.38)
  Top 0.203: v56.39,34.29 56.39,35.66
  Top 0.254: 56.39,35.66 R15.1
  Bottom 0.254: IC3.JRST 56.32,33.97 v56.39,34.29
RESET  (via drill 0.38)
  Top 0.203: v53.59,25.4 52.32,24.13 52.32,20.07 50.29,18.03 49.28,18.03 | 49.28,18.03 45.97,18.03 v45.47,17.53 | RESET.P$2 32.47,2.25 J2.1 33.02,7.07 R1.2 32.77,7.33 v32.77,9.91 | UC1.P$7 49.31,18 49.28,18.03
  Bottom 0.203: IC3.RESETN 53.78,25.59 v53.59,25.4 | v45.47,17.53 45.47,13.21 43.43,11.18 34.04,11.18 v32.77,9.91
SD_CLK  (via drill 0.38)
  Top 0.203: UC1.P$53 40.85,23.92 39.37,25.4 v39.37,29.72 | U1.5 12.52,38.03 12.95,37.59 22.1,37.59 v25.4,34.29
  Bottom 0.203: v25.4,34.29 34.8,34.29 v39.37,29.72
SD_CMD  (via drill 0.38)
  Top 0.203: UC1.P$54 40.33,23.42 38.35,25.4 v38.35,29.46 | U1.3 13.22,35.83 13.97,36.58 21.34,36.58 v23.62,34.29
  Bottom 0.203: v23.62,34.29 24.64,33.27 34.54,33.27 v38.35,29.46
SD_D0  (via drill 0.38)
  Top 0.203: UC1.P$39 50.81,33.52 v49.78,34.54 | v44.2,34.54 34.8,34.54 34.04,35.31 25.15,35.31 22.1,38.35 12.95,38.35 11.08,40.23 U1.7
  Bottom 0.203: v44.2,34.54 v49.78,34.54
SD_D1  (via drill 0.38)
  Top 0.203: UC1.P$40 50.31,32.74 49.02,34.04 v49.02,35.81 | U1.8 12.27,41.33 14.73,38.86 22.35,38.86 25.4,35.81 34.29,35.81 35.05,35.05 36.58,35.05 37.34,35.81 v44.2,35.81
  Bottom 0.203: v44.2,35.81 v49.02,35.81
SD_D2  (via drill 0.38)
  Top 0.203: UC1.P$51 42.13,24.92 41.15,25.91 v41.15,27.18 | v21.59,33.53 18.8,33.53 17.78,32.51 14.73,32.51 13.62,33.63 U1.1
  Bottom 0.203: v41.15,27.18 37.85,27.18 33.02,32 23.11,32 v21.59,33.53
SD_D3  (via drill 0.38)
  Top 0.203: UC1.P$52 41.36,24.42 40.13,25.65 v40.13,28.45 | U1.2 13.53,34.73 14.99,33.27 16.76,33.27 v18.03,34.54
  Bottom 0.203: v18.03,34.54 22.1,34.54 24.13,32.51 34.04,32.51 38.1,28.45 v40.13,28.45
USBDM
  Top 0.203: X1.D- 11.56,22.39 R12.2
USBDP
  Top 0.203: X1.D+ 10.16,21.59 10.67,21.08 R13.2
VCC  (via drill 0.38)
  Top 0.203: v60.96,35.05 60.96,36.31 | R14.2 v53.85,39.12 | UC1.P$32 57.9,25.92 v57.91,25.91 59.27,25.91 | 57.91,19.67 v57.91,21.08 | C13.1 59.97,13.48 v59.94,13.46 | UC1.P$19 56.76,19.42 57.4,20.07 58.02,20.07 C4.1 | C2.1 46.31,29.09 UC1.P$48 46.31,26.76 v46.23,26.67 | UC1.P$1 44.56,16.24 C5.1 | UC1.P$64 44.13,16.67 C5.1 | v42.93,16.76 44.03,16.76 C5.1 | R2.1 32.85,14.82 v32.77,14.73 | U1.4 7.21,36.93 v7.37,37.08 | v30.99,5.84 30.99,7.07 R1.1 | D4.A D3.A 25.13,39.38 v25.15,39.37
  Top 0.254: 60.96,36.31 C14.1 | 59.27,25.91 C3.1 | C4.1 57.91,19.67
  Top 0.406: R7.2 11.6,14.99 v9.4,14.99 | Q1.3 16.13,17.27 v17.53,17.27 | IC2.2 25.59,8.72 C12.+ 25.15,8.28 v25.15,6.35
  Bottom 0.203: IC3.VDD33_17 66.48,33.34 66.29,33.53 65.53,33.53 64.52,34.54 61.47,34.54 v60.96,35.05 | v59.94,13.46 56.39,13.46 55.12,12.19 55.12,11.15 IC3.VDD33_29
  pour Route15 (isolate 0.254): 34.04,11.18 49.02,11.18 49.02,17.02 52.83,17.02 52.83,15.49 58.04,15.49 58.04,12.7 64.52,12.7 64.39,37.72 64.39,47.12 21.59,47.24 21.59,53.21 1.53,53.21 arc90 0.61,52.3 0.73,1.84 arc91 1.83,0.76 36.7,0.74 36.7,4.06 33.15,5.71 33.15,10.29
VDD  (via drill 0.38)
  Top 0.203: UC1.P$13 52.31,14.91 C1.1 53.09,14.14 v53.09,13.21
  Top 0.813: IC1.2 32.5,12.21 v35.05,9.65 35.05,8.48 C10.+
  Route15 0.813: J2.3 38.1,5.84
  pour Route15: 38.1,10.41 34.29,10.41 34.29,8.51 37.34,4.7 50.16,4.7 50.16,1.52 64.77,1.52 64.77,3.56 68.33,5.84 68.33,17.27 65.02,17.27 65.02,12.19 57.02,12.19 57.02,14.86 49.66,14.86 49.66,11.43 50.67,10.41 50.67,5.97 41.27,5.97
VIN  (via drill 0.38)
  Top 0.203: R16.2 21.34,41.66 21.84,41.15 v21.84,39.88
  Top 0.406: C15.1 20.31,15.67 v20.31,14.23 | v30.43,14.3 v30.42,14.31 IC1.3 IC2.3 24.56,14.23 v20.31,14.23 | v20.32,14.22 v20.31,14.23
  Top 0.813: v20.32,14.22 20.32,11.43 21.84,9.91 21.84,8.48 C11.+ | PWR.1 PWR.3 PWR.5 PWR.7
  Route15 0.813: PWR.1 20.31,38.35 v21.84,39.88 | PWR.7 v20.31,14.23 v20.32,14.22
  Bottom 0.406: J2.6 45.72,4.32 44.45,5.59 32.77,5.59 30.42,7.93 v30.42,14.31
WI_MISO  (via drill 0.38)
  Top 0.203: UC1.P$35 52.81,26.65 50.29,24.13 v50.29,19.56
  Bottom 0.203: v50.29,19.56 51.31,18.54 51.31,11.15 IC3.SDO
WI_MOSI  (via drill 0.38)
  Top 0.203: UC1.P$36 52.31,27.17 v49.28,24.13
  Bottom 0.203: v49.28,24.13 49.28,21.34 47.5,19.56 47.5,11.15 IC3.SDI
WI_SCK  (via drill 0.38)
  Top 0.203: v51.31,22.35 51.31,24.13 53.31,26.14 UC1.P$34
  Bottom 0.203: IC3.SCK 48.7,19.75 v51.31,22.35
WI_SS_N  (via drill 0.38)
  Top 0.203: v62.66,26.37 62.66,26.49 61.85,27.3 61.72,27.43 57.4,27.43 56.78,28.06 UC1.P$33
  Bottom 0.203: IC3.SS_N 62.67,26.35
  Bottom 0.254: 62.67,26.35 v62.66,26.37

### Text on the board
tPlace: 14 | GND | 13 | 12 | 11 | 10 | 9 | 8 | 7 | 6 | 5 | 4 | 3 | 2 | 1 | 0 | 3.7V LiPo | PWM | PWM | PWM | PWM | PWM | PWM | PWM | PWM | PWM | PWM | PWM | PWM | AIN | AIN | AIN | AIN | RX1 | TX1 | AIN | AIN | AIN | TX2 | RX2 | DONE | CHRG | CHRG | PWRSEL | BAT | STM32 | USB | EXT | EXT | + | AIN | AIN | AIN | AIN | AIN | AIN | RST | VCC | VDDA | GND | Vin | 15 | 16 | 17 | 18 | 19 | 20 | - | 7-18V
bPlace: GND | 14 | 13 | 12 | 11 | 10 | 9 | 8 | 7 | 6 | 5 | 4 | 3 | 3 | 2 | 1 | 0 | ck | miso | mosi | ss | SPI1 | I2C1-SDA | I2C1-SCL | bumble-b, rev 1 | soundcyst 2010 | RST | VCC | VDDA | GND | Vin | 15 | AIN | 16 | AIN | 17 | AIN | 18 | AIN | 19 | AIN | 20 | AIN
tValues: DNP | DNP | JST-Right Angle | DNP | DNP | DNP | DNP